# EAGLE schematic delay (EAGLE 7.1.0)
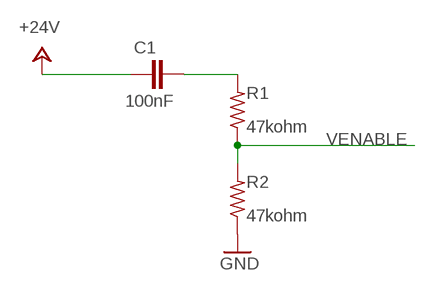
[diagram p0: schematic, sheet 1]

## Parts
C1  100nF  C-EU025-025X050  [C025-025X050]
R1  47kohm  R-US_0207/10  [0207/10]
R2  47kohm  R-US_0207/10  [0207/10]

## Nets
+24V: C1.1
GND: R2.1
N$1: C1.2 R1.2
VENABLE: R1.1 R2.2

## Library data of the parts
C1 = resistor:C-EU: CAPACITOR, European symbol; SPICEPREFIX: C
R1 R2 = resistor:R-US_: RESISTOR, American symbol